# Altium schematic sheet sja1000.SCHDOC
size A4; Organization: UNSW Solar Racing Team; Address3: UNSW; Address4: Sydney NSW 2052; Address2: Electrical Engineering; Address1: Rm 109
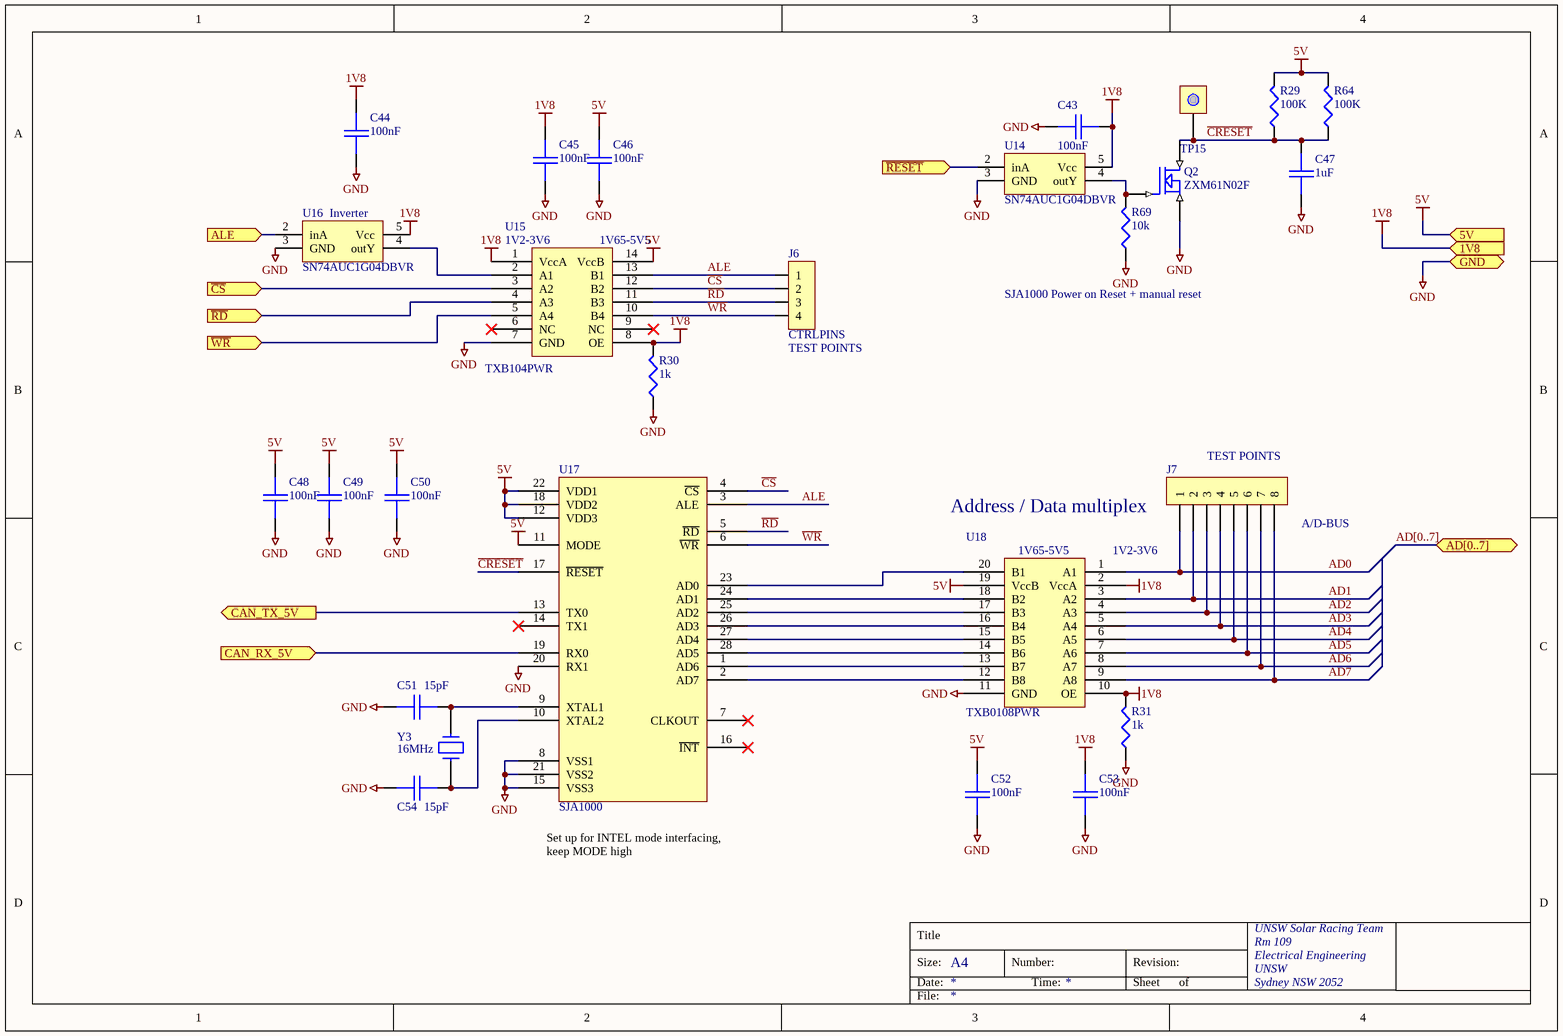
[diagram p0: sja1000.SCHDOC]

## Parts
C43  100nF  [0603]
C44  100nF  [0603]
C45  100nF  [0603]
C46  100nF  [0603]
C47  1uF  [0805]
C48  100nF  [0603]
C49  100nF  [0603]
C50  100nF  [0603]
C51  15pF  [0603]
C52  100nF  [0603]
C53  100nF  [0603]
C54  15pF  [0603]
J6  CTRLPINS  [IDC4]
J7  A/D-BUS  [IDC8]
Q2  ZXM61N02F  [SOT23-3]
R29  100K  [0603]
R30  1k  [0603]
R31  1k  [0603]
R64  100K  [0603]
R69  10k  [0603]
TP15  CRESET  [TESTPOINT]  (value not drawn)
U14  SN74AUC1G04DBVR  [SOT23-5]
U15  TXB104PWR  [TSSOP14-L]
U16  SN74AUC1G04DBVR  [SOT23-5]
U17  SJA1000  [SO28(SOT136-1)]
U18  TXB0108PWR  [TSSOP20-L]
Y3  16MHz  [HC49/4H]

## Ports
1V8 (in), 5V (in), AD[0..7] (bidir), ALE (in), CAN_RX_5V (in), CAN_TX_5V (out), GND, ~{CS} (in), ~{RD} (in), ~{RESET} (in), ~{WR} (in)

## Nets
1V8: C43.2 C44.2 C45.2 C53.2 R30.2 R31.2 U14.5(Vcc) U15.1(VccA) U15.8(OE) U16.5(Vcc) U18.2(VccA) U18.10(OE) ; port 1V8
5V: C46.2 C48.2 C49.2 C50.2 C52.2 R29.2 R64.2 U15.14(VccB) U17.11(MODE) U17.12(VDD3) U17.18(VDD2) U17.22(VDD1) U18.19(VccB) ; port 5V
GND: C43.1 C44.1 C45.1 C46.1 C47.2 C48.1 C49.1 C50.1 C51.1 C52.1 C53.1 C54.1 Q2.2(S) R30.1 R31.1 R69.1 U14.3(GND) U15.7(GND) U16.3(GND) U17.8(VSS1) U17.15(VSS3) U17.20(RX1) U17.21(VSS2) U18.11(GND) ; port GND
AD0: J7.1 U18.1(A1)
AD1: J7.2 U18.3(A2)
AD2: J7.3 U18.4(A3)
AD3: J7.4 U18.5(A4)
AD4: J7.5 U18.6(A5)
AD5: J7.6 U18.7(A6)
AD6: J7.7 U18.8(A7)
AD7: J7.8 U18.9(A8)
ALE: J6.1 U15.13(B1) U17.3(ALE)
ALE: U16.2(inA) ; port ALE  [a separate net that carries the same name]
~{CRESET}: C47.1 Q2.3(D) R29.1 R64.1 TP15.0(TP) U17.17(~{RESET})
~{CS}: J6.2 U15.12(B2) U17.4(~{CS})
~{CS}: U15.3(A2) ; port ~{CS}  [a separate net that carries the same name]
CAN_RX_5V: U17.19(RX0) ; port CAN_RX_5V
CAN_TX_5V: U17.13(TX0) ; port CAN_TX_5V
~{RD}: J6.3 U15.11(B3) U17.5(~{RD})
~{RD}: U15.4(A3) ; port ~{RD}  [a separate net that carries the same name]
~{RESET}: U14.2(inA) ; port ~{RESET}
~{WR}: J6.4 U15.10(B4) U17.6(~{WR})
~{WR}: U15.5(A4) ; port ~{WR}  [a separate net that carries the same name]
NetC51_2: C51.2 U17.9(XTAL1) Y3.2
NetC54_2: C54.2 U17.10(XTAL2) Y3.1
NetQ2_1: Q2.1(G) R69.2 U14.4(outY)
NetU15_2: U15.2(A1) U16.4(outY)
NetU17_1: U17.1(AD6) U18.13(B7)
NetU17_2: U17.2(AD7) U18.12(B8)
NetU17_23: U17.23(AD0) U18.20(B1)
NetU17_24: U17.24(AD1) U18.18(B2)
NetU17_25: U17.25(AD2) U18.17(B3)
NetU17_26: U17.26(AD3) U18.16(B4)
NetU17_27: U17.27(AD4) U18.15(B5)
NetU17_28: U17.28(AD5) U18.14(B6)

Not connected (* = marked no-connect by the designer): U15 6(NC)* 9(NC)*; U17 7(CLKOUT)* 14(TX1)* 16(~{INT})*

## Buses and harness runs
bus AD[0..7] = port AD[0..7]

## Notes on the sheet
- (near U16) Inverter
- (near R69) SJA1000 Power on Reset + manual reset
- (near J6) TEST POINTS
- (near J7) Address / Data multiplex
- (near J7) TEST POINTS
- (near U17) Set up for INTEL mode interfacing,
  keep MODE high
- Title
- Size:
- Date:
- A4
- Number:
- Time:
- Revision:
- Sheet
- of
- File:
- (in symbol TXB0104PWR) 1V2-3V6; 1V65-5V5
- (in symbol TXB0108PWR) 1V65-5V5; 1V2-3V6

## Library data of the parts
C43-C54 = CAP: Capacitor
J6 = CON4: Connector; Farnell: 3417748; FarnellPrice: 0.656
J7 = CON8: 8 Pin 3.5mm Screw Terminal  header; Farnell: 3417761; FarnellPrice: 0.909
Q2 = ZXM61N02F: 1.7A, 20V N-Channel Enhancement mode FET; Digikey: ZXM61N02FCT-ND; DigikeyPrice: 0.66; Farnell: 9525270; FarnellPrice: 1.35
R29-R31 R64 R69 = RES1: Resistor
  R29 R64: Farnell: 1344361; FarnellPrice: 0.02; Digikey: CRT0603-BY-1003ELFCT-ND; DigikeyPrice: 0.25
  R30 R31: Farnell: Stock
TP15 = TEST: TEST POINT
U14 U16 = SN74AUC1G04DBVR: 1.8V Single Inverter Gate; Digikey: 296-13168-1-ND
U15 = TXB0104PWR: 4 bit bidirectional auto direction sense level translator; Digikey: 296-21929-1-ND; Farnell: 1607891; FarnellPrice: 3.1; DigikeyPrice: 1.93
U17 = SJA1000: CAN Controller; Digikey: 568-1123-1-ND; DigikeyPrice: 7.02; Farnell: 1775880; FarnellPrice: 11.8
U18 = TXB0108PWR: 4 bit bidirectional auto direction sense level translator; Digikey: 296-21527-1-ND; DigikeyPrice: 2.8; Farnell: 1770557; FarnellPrice: 4.5
Y3 = CRYSTAL: Digikey: 300-8499-ND; DigikeyPrice: 0.63